# Altium project 主驱一体板1.5.PrjPcb
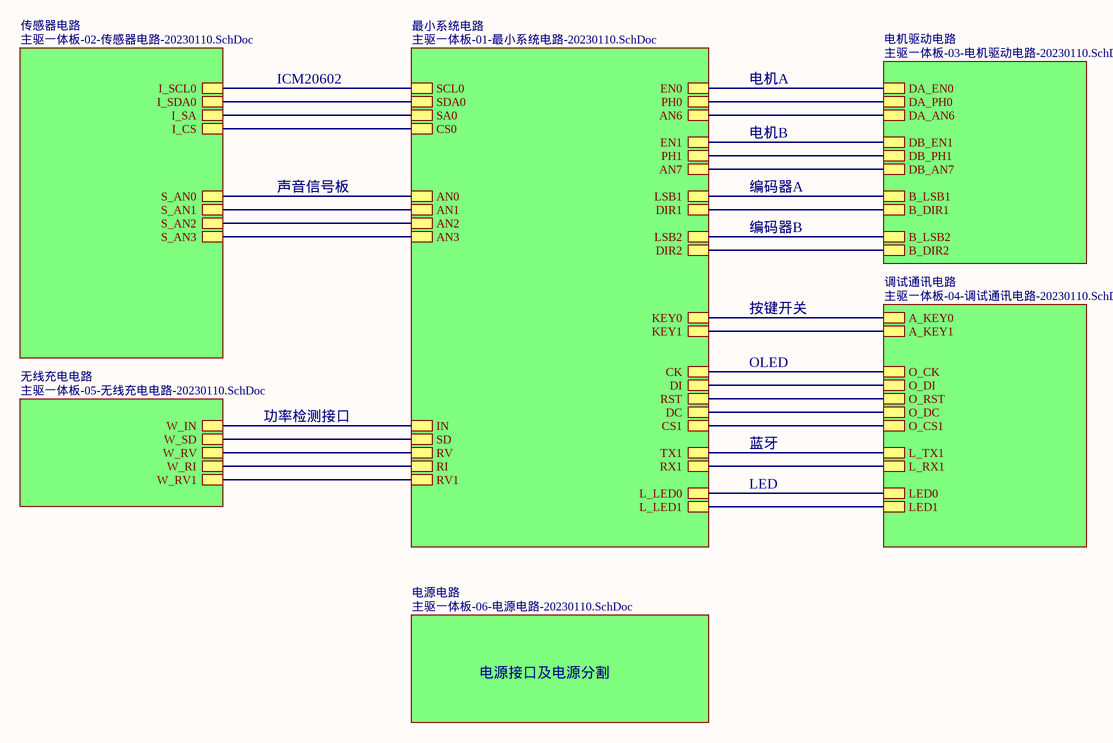
[diagram p0: 主驱一体板1.5.SchDoc]
2 sheets, 74 parts. Net scope: hierarchical (ports join the sheet entries above them; power ports are global).
Board file: 主驱一体板1.5.PcbDoc
Sheets:
  主驱一体板1.5.SchDoc
    电机驱动电路 = 主驱一体板-03-电机驱动电路-20230110.SchDoc

## Sheet 主驱一体板1.5.SchDoc
size A4

### Sub-sheets
传感器电路 = 主驱一体板-02-传感器电路-20230110.SchDoc (file not in this document): I_CS, I_SA, I_SDA0, I_SCL0, S_AN0, S_AN1, S_AN2, S_AN3
无线充电电路 = 主驱一体板-05-无线充电电路-20230110.SchDoc (file not in this document): W_IN, W_SD, W_RV, W_RI, W_RV1
最小系统电路 = 主驱一体板-01-最小系统电路-20230110.SchDoc (file not in this document): SCL0, SDA0, SA0, CS0, LSB1, LSB2, DIR1, DIR2, AN0, AN1, AN2, AN3, KEY0, KEY1, CK, DI, RST, DC, CS1, EN0, EN1, PH0, PH1, AN6, AN7, IN, SD, RV, RI, RV1, TX1, RX1, L_LED0, L_LED1
电机驱动电路 = 主驱一体板-03-电机驱动电路-20230110.SchDoc: DA_EN0, DA_PH0, DB_EN1, DB_PH1, DA_AN6, DB_AN7, B_LSB1, B_LSB2, B_DIR1, B_DIR2
电源电路 = 主驱一体板-06-电源电路-20230110.SchDoc (file not in this document): no entries
调试通讯电路 = 主驱一体板-04-调试通讯电路-20230110.SchDoc (file not in this document): A_KEY0, A_KEY1, O_CK, O_DI, O_RST, O_DC, O_CS1, L_TX1, L_RX1, LED0, LED1

### Nets
NetC28_2: sheet 最小系统电路/AN6, sheet 电机驱动电路/DA_AN6
NetC37_2: sheet 最小系统电路/AN7, sheet 电机驱动电路/DB_AN7
NetP3_3: sheet 最小系统电路/LSB1, sheet 电机驱动电路/B_LSB1
NetP3_4: sheet 最小系统电路/DIR1, sheet 电机驱动电路/B_DIR1
NetP4_3: sheet 最小系统电路/LSB2, sheet 电机驱动电路/B_LSB2
NetP4_4: sheet 最小系统电路/DIR2, sheet 电机驱动电路/B_DIR2
NetR38_1: sheet 最小系统电路/PH0, sheet 电机驱动电路/DA_PH0
NetR39_1: sheet 最小系统电路/EN0, sheet 电机驱动电路/DA_EN0
NetR40_2: sheet 最小系统电路/PH1, sheet 电机驱动电路/DB_PH1
NetR41_2: sheet 最小系统电路/EN1, sheet 电机驱动电路/DB_EN1
(unnamed): sheet 最小系统电路/SCL0, sheet 传感器电路/I_SCL0
(unnamed): sheet 最小系统电路/SDA0, sheet 传感器电路/I_SDA0
(unnamed): sheet 最小系统电路/SA0, sheet 传感器电路/I_SA
(unnamed): sheet 最小系统电路/CS0, sheet 传感器电路/I_CS
(unnamed): sheet 最小系统电路/AN0, sheet 传感器电路/S_AN0
(unnamed): sheet 最小系统电路/AN1, sheet 传感器电路/S_AN1
(unnamed): sheet 最小系统电路/AN2, sheet 传感器电路/S_AN2
(unnamed): sheet 最小系统电路/AN3, sheet 传感器电路/S_AN3
(unnamed): sheet 最小系统电路/KEY0, sheet 调试通讯电路/A_KEY0
(unnamed): sheet 最小系统电路/KEY1, sheet 调试通讯电路/A_KEY1
(unnamed): sheet 最小系统电路/CK, sheet 调试通讯电路/O_CK
(unnamed): sheet 最小系统电路/DI, sheet 调试通讯电路/O_DI
(unnamed): sheet 最小系统电路/RST, sheet 调试通讯电路/O_RST
(unnamed): sheet 最小系统电路/DC, sheet 调试通讯电路/O_DC
(unnamed): sheet 最小系统电路/CS1, sheet 调试通讯电路/O_CS1
(unnamed): sheet 最小系统电路/IN, sheet 无线充电电路/W_IN
(unnamed): sheet 最小系统电路/SD, sheet 无线充电电路/W_SD
(unnamed): sheet 最小系统电路/RV, sheet 无线充电电路/W_RV
(unnamed): sheet 最小系统电路/RI, sheet 无线充电电路/W_RI
(unnamed): sheet 最小系统电路/RV1, sheet 无线充电电路/W_RV1
(unnamed): sheet 最小系统电路/TX1, sheet 调试通讯电路/L_TX1
(unnamed): sheet 最小系统电路/RX1, sheet 调试通讯电路/L_RX1
(unnamed): sheet 最小系统电路/L_LED0, sheet 调试通讯电路/LED0
(unnamed): sheet 最小系统电路/L_LED1, sheet 调试通讯电路/LED1

### Notes on the sheet
- ICM20602
- 电机A
- 电机B
- 声音信号板
- 编码器A
- 编码器B
- 按键开关
- OLED
- 功率检测接口
- 蓝牙
- LED
- 电源接口及电源分割

## Sheet 主驱一体板-03-电机驱动电路-20230110.SchDoc
size A4
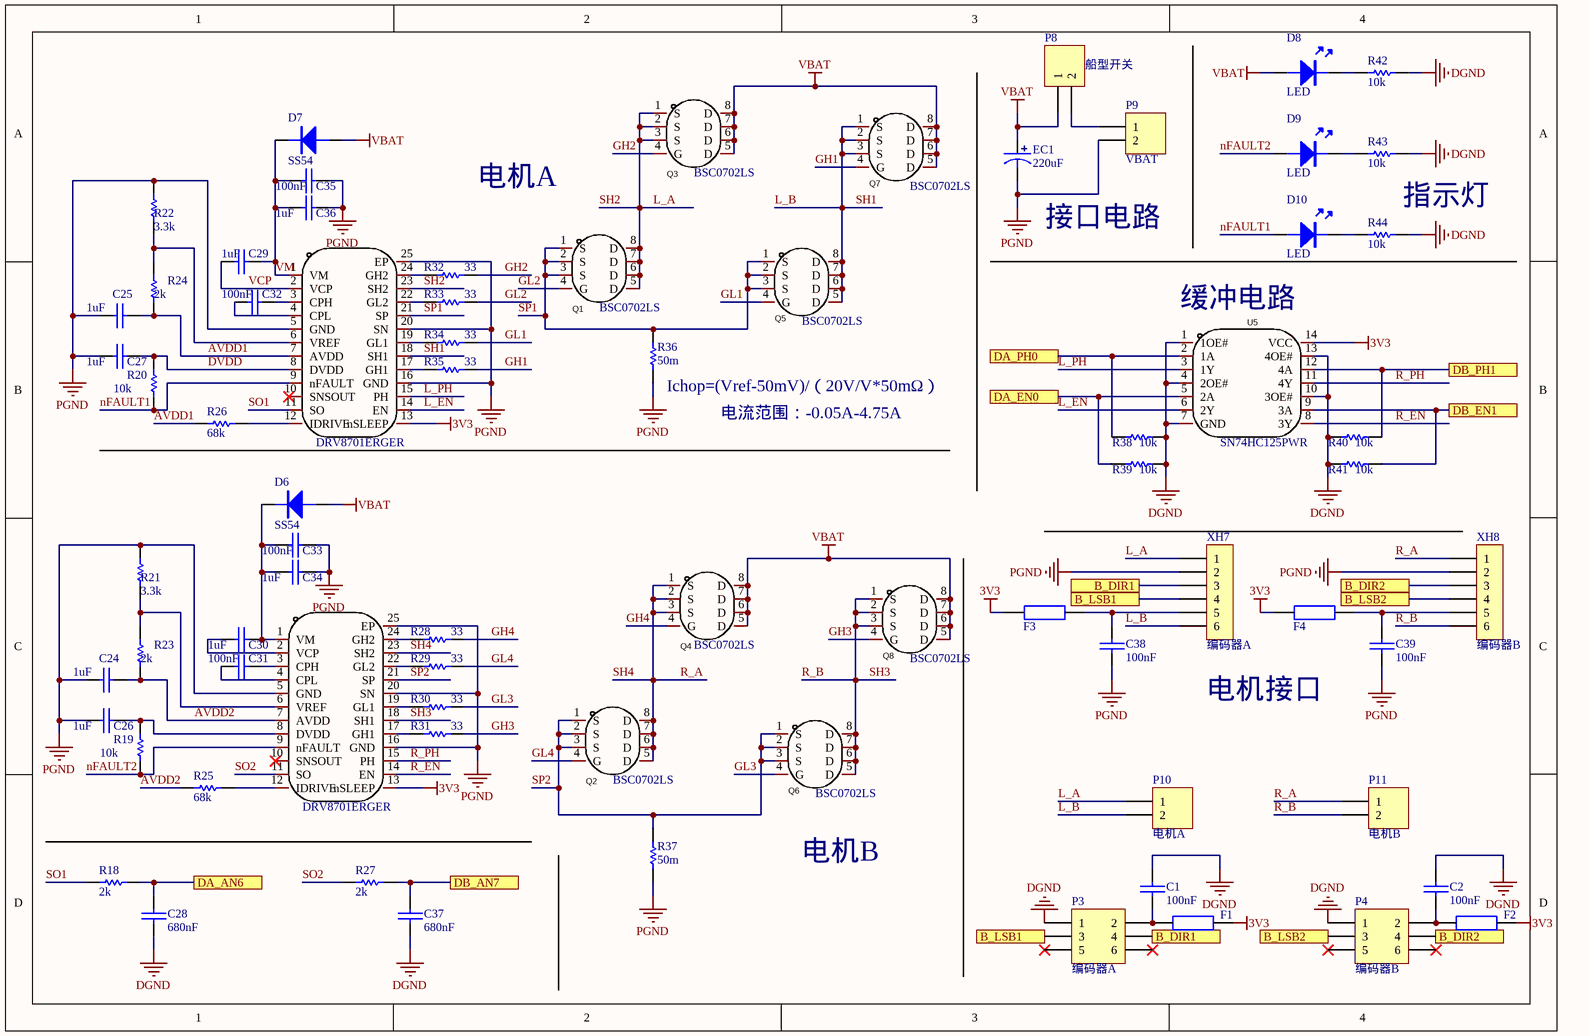
[diagram p1: 主驱一体板-03-电机驱动电路-20230110.SchDoc]

### Parts
C1  100nF  [0402C]
C2  100nF  [0402C]
C24  1uF  [0402C]
C25  1uF  [0402C]
C26  1uF  [0402C]
C27  1uF  [0402C]
C28  680nF  [0402C]
C29  1uF  [0402C]
C30  1uF  [0402C]
C31  100nF  [0402C]
C32  100nF  [0402C]
C33  100nF  [0402C]
C34  1uF  [0402C]
C35  100nF  [0402C]
C36  1uF  [0402C]
C37  680nF  [0402C]
C38  100nF  [0402C]
C39  100nF  [0402C]
D6  SS54  [SMA/DO-214AC]
D7  SS54  [SMA/DO-214AC]
D8  LED  [LED-0603B]
D9  LED  [LED-0603B]
D10  LED  [LED-0603B]
EC1  220uF  [SMD-EC6.3X6.3X10]
F1  500MA 0805  [0402]  (value not drawn)
F2  500MA 0805  [0402]  (value not drawn)
F3  500MA 0805  [0402R]  (value not drawn)
F4  500MA 0805  [0402R]  (value not drawn)
P3  编码器A  [HDR2X3]
P4  编码器B  [HDR2X3]
P8  船型开关  [船型开关]
P9  VBAT  [XT30U-M]
P10  电机A  [XT30U-M]
P11  电机B  [XT30U-M]
Q1  BSC0702LS  [BSC0702LS]
Q2  BSC0702LS  [BSC0702LS]
Q3  BSC0702LS  [BSC0702LS]
Q4  BSC0702LS  [BSC0702LS]
Q5  BSC0702LS  [BSC0702LS]
Q6  BSC0702LS  [BSC0702LS]
Q7  BSC0702LS  [BSC0702LS]
Q8  BSC0702LS  [BSC0702LS]
R18  2k  [0402R]
R19  10k  [0402R]
R20  10k  [0402R]
R21  3.3k  [0402R]
R22  3.3k  [0402R]
R23  2k  [0402R]
R24  2k  [0402R]
R25  68k  [0402R]
R26  68k  [0402R]
R27  2k  [0402R]
R28  33  [0402R]
R29  33  [0402R]
R30  33  [0402R]
R31  33  [0402R]
R32  33  [0402R]
R33  33  [0402R]
R34  33  [0402R]
R35  33  [0402R]
R36  50m  [1206R]
R37  50m  [1206R]
R38  10k  [0402R]
R39  10k  [0402R]
R40  10k  [0402R]
R41  10k  [0402R]
R42  10k  [0402R]
R43  10k  [0402R]
R44  10k  [0402R]
U3  DRV8701ERGER  [DRV8701ERGER]
U4  DRV8701ERGER  [DRV8701ERGER]
U5  SN74HC125PWR  [SN74HC125PWR]
XH7  编码器A  [XH6/2.54mm/180]
XH8  编码器B  [XH6/2.54mm/180]

### Ports
B_DIR1, B_DIR2, B_LSB1, B_LSB2, DA_AN6, DA_EN0, DA_PH0, DB_AN7, DB_EN1, DB_PH1

### Nets
3V3: F1.2 F2.1 F3.2 F4.1 U3.13(nSLEEP) U4.13(nSLEEP) U5.14(VCC)
DGND: C1.2 C2.2 C28.1 C37.1 P3.1 P4.1 R38.2 R39.2 R40.1 R41.1 R42.1 R43.1 R44.1 U5.1(1OE#) U5.4(2OE#) U5.7(GND) U5.10(3OE#) U5.13(4OE#)
PGND: C24.1 C25.1 C26.1 C27.1 C33.2 C34.2 C35.2 C36.2 C38.2 C39.2 EC1.2 P9.2 R21.1 R22.1 R36.1 R37.1 U3.5(GND) U3.16(GND) U3.20(SN) U3.25(EP) U4.5(GND) U4.16(GND) U4.20(SN) U4.25(EP) XH7.2 XH8.2
VBAT: D6.A D7.A D8.A EC1.1 P8.1 Q3.5(D) Q3.6(D) Q3.7(D) Q3.8(D) Q4.5(D) Q4.6(D) Q4.7(D) Q4.8(D) Q7.5(D) Q7.6(D) Q7.7(D) Q7.8(D) Q8.5(D) Q8.6(D) Q8.7(D) Q8.8(D)
AVDD1: C25.2 R24.2 R26.1 U4.7(AVDD)
AVDD2: C24.2 R23.2 R25.1 U3.7(AVDD)
DVDD: C27.2 R20.1 U4.8(DVDD)
GH1: Q7.4(G) R35.2
GH2: Q3.4(G) R32.2
GH3: Q8.4(G) R31.2
GH4: Q4.4(G) R28.2
GL1: Q5.4(G) R34.2
GL2: Q1.4(G) R33.2
GL3: Q6.4(G) R30.2
GL4: Q2.4(G) R29.2
L_A: P10.1 Q1.5(D) Q1.6(D) Q1.7(D) Q1.8(D) Q3.1(S) Q3.2(S) Q3.3(S) U4.23(SH2) XH7.1  [also labelled SH2]
L_B: P10.2 Q5.5(D) Q5.6(D) Q5.7(D) Q5.8(D) Q7.1(S) Q7.2(S) Q7.3(S) U4.18(SH1) XH7.6  [also labelled SH1]
L_EN: U4.14(EN) U5.6(2Y)
L_PH: U4.15(PH) U5.3(1Y)
nFAULT1: D10.A R20.2 U4.9(nFAULT)
nFAULT2: D9.A R19.2 U3.9(nFAULT)
R_A: P11.1 Q2.5(D) Q2.6(D) Q2.7(D) Q2.8(D) Q4.1(S) Q4.2(S) Q4.3(S) U3.23(SH2) XH8.1  [also labelled SH4]
R_B: P11.2 Q6.5(D) Q6.6(D) Q6.7(D) Q6.8(D) Q8.1(S) Q8.2(S) Q8.3(S) U3.18(SH1) XH8.6  [also labelled SH3]
R_EN: U3.14(EN) U5.8(3Y)
R_PH: U3.15(PH) U5.11(4Y)
SO1: R18.1 U4.11(SO)
SO2: R27.1 U3.11(SO)
SP1: Q1.1(S) Q1.2(S) Q1.3(S) Q5.1(S) Q5.2(S) Q5.3(S) R36.2 U4.21(SP)
SP2: Q2.1(S) Q2.2(S) Q2.3(S) Q6.1(S) Q6.2(S) Q6.3(S) R37.2 U3.21(SP)
VCP: C29.1 U4.2(VCP)
VM: C29.2 C35.1 C36.1 D7.K U4.1(VM)
NetC1_1: C1.1 F1.1 P3.2
NetC2_1: C2.1 F2.2 P4.2
NetC26_2: C26.2 R19.1 U3.8(DVDD)
NetC28_2: C28.2 R18.2 ; port DA_AN6
NetC30_1: C30.1 U3.2(VCP)
NetC30_2: C30.2 C33.1 C34.1 D6.K U3.1(VM)
NetC31_1: C31.1 U3.4(CPL)
NetC31_2: C31.2 U3.3(CPH)
NetC32_1: C32.1 U4.4(CPL)
NetC32_2: C32.2 U4.3(CPH)
NetC37_2: C37.2 R27.2 ; port DB_AN7
NetC38_1: C38.1 F3.1 XH7.5
NetC39_1: C39.1 F4.2 XH8.5
NetD8_K: D8.K R42.2
NetD9_K: D9.K R43.2
NetD10_K: D10.K R44.2
NetP3_3: P3.3 XH7.4 ; port B_LSB1
NetP3_4: P3.4 XH7.3 ; port B_DIR1
NetP4_3: P4.3 XH8.4 ; port B_LSB2
NetP4_4: P4.4 XH8.3 ; port B_DIR2
NetP8_2: P8.2 P9.1
NetR21_2: R21.2 R23.1 U3.6(VREF)
NetR22_2: R22.2 R24.1 U4.6(VREF)
NetR25_2: R25.2 U3.12(IDRIVE)
NetR26_2: R26.2 U4.12(IDRIVE)
NetR28_1: R28.1 U3.24(GH2)
NetR29_1: R29.1 U3.22(GL2)
NetR30_1: R30.1 U3.19(GL1)
NetR31_1: R31.1 U3.17(GH1)
NetR32_1: R32.1 U4.24(GH2)
NetR33_1: R33.1 U4.22(GL2)
NetR34_1: R34.1 U4.19(GL1)
NetR35_1: R35.1 U4.17(GH1)
NetR38_1: R38.1 U5.2(1A) ; port DA_PH0
NetR39_1: R39.1 U5.5(2A) ; port DA_EN0
NetR40_2: R40.2 U5.12(4A) ; port DB_PH1
NetR41_2: R41.2 U5.9(3A) ; port DB_EN1

Not connected (* = marked no-connect by the designer): P3 5* 6*; P4 5* 6*; U3 10(SNSOUT)*; U4 10(SNSOUT)*

### Notes on the sheet
- 电机A
- 接口电路
- 指示灯
- (near U5) 缓冲电路
- (near R36) Ichop=(Vref-50mV)/（20V/V*50mΩ）
- 电流范围：-0.05A-4.75A
- 电机接口
- 电机B

### Library data of the parts
C1 C24-C38 = CAP: 无极性电容
C2 C39 = CAP
D6 D7 = DIODE: 普通二极管
EC1 = SMD_ECAP: 贴片电解电容
F1-F4 = 0805 R_2
P3 P4 = Header 3X2: Header, 3-Pin, Dual row; LatestRevisionDate: 17-Jul-2002; LatestRevisionNote: Re-released for DXP Platform.; Publisher: Altium Limited
P8-P11 = Header 2: Header, 2-Pin; LatestRevisionDate: 17-Jul-2002; LatestRevisionNote: Re-released for DXP Platform.; Publisher: Altium Limited
Q1-Q8 = BSC0702LS: Manufacturer: Infineon(英飞凌); Add into BOM: yes; Type: N沟道; Drain Source Voltage (Vdss): 60V; Continuous Drain Current (Id): 100A; Power Dissipation (Pd): 83W; Drain Source On Resistance (RDS(on)@Vgs,Id): 2.3mΩ@10V,50A; Gate Threshold Voltage (Vgs(th)@Id): 2.3V@49μA; Name: BSC0702LS; Symbol: BSC0702LS; Device: BSC0702LS; LCSC Part Name: N沟道 60V 100A; Supplier Part: C501503; Manufacturer Part: BSC0702LS; Supplier Footprint: PG-TDSON-8; JLCPCB Part Class: Extended Part; Datasheet: https://atta.szlcsc.com/upload/public/pdf/source/20200324/C501503_BE3C55BAEEDCAD77F3934BFEE5415F86.pdf; Supplier: LCSC; Convert to PCB: yes
R18-R44 = RES
U3 U4 = DRV8701ERGER: Manufacturer: TI(德州仪器); Add into BOM: yes; Supply Voltage: 0V~5.5V; Interface: 并行; Name: DRV8701ERGER; Symbol: DRV8701ERGER; Device: DRV8701ERGER; LCSC Part Name: DRV8701ERGER; Supplier Part: C90964; Manufacturer Part: DRV8701ERGER; Supplier Footprint: VQFN-24; JLCPCB Part Class: Extended Part; Datasheet: https://atta.szlcsc.com/upload/public/pdf/source/20190902/C90964_2DCC43C1A4AE58E3ED96296E8C78517C.pdf; Supplier: LCSC; Convert to PCB: yes; Type: 有刷直流电机; current output: -; Operating Temperature: -40℃~+125℃@(Ta)
U5 = SN74HC125PWR: Manufacturer: TI(德州仪器); Add into BOM: yes; Logic Type: 缓冲器，非反向; Number of Elements: 4; Number of Bits per Element: 1; Output Type: 三态; Current - Output High, Low: 7.8mA、7.8mA; Voltage - Supply: 2V ~ 6V; Name: SN74HC125PWR; Symbol: SN74HC125PWR; Device: SN74HC125PWR; LCSC Part Name: SN74HC125PWR; Supplier Part: C132994; Manufacturer Part: SN74HC125PWR; Supplier Footprint: TSSOP-14; JLCPCB Part Class: Extended Part; Datasheet: https://atta.szlcsc.com/upload/public/pdf/source/20170930/C132994_1506736365150997346.pdf; Supplier: LCSC; Convert to PCB: yes; Series: 74HC; Input Type: -; Operating Temperature: -40℃~+85℃（TA）
XH7 XH8 = XH6